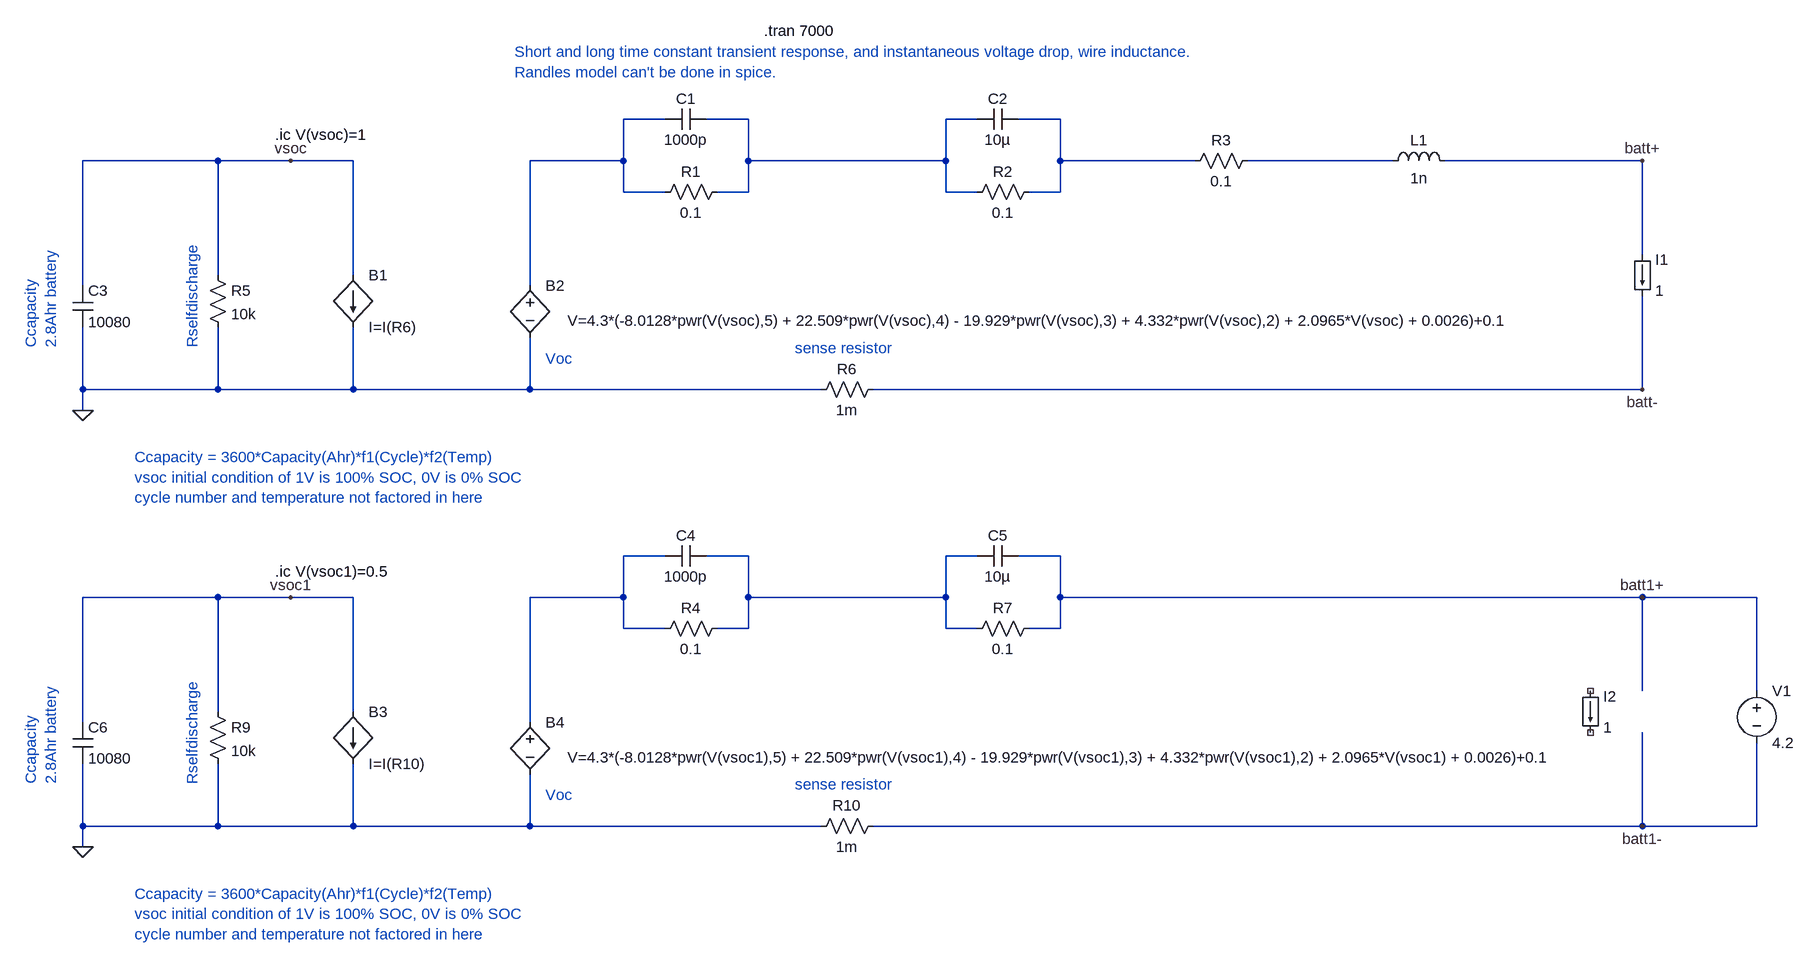
[diagram p0: schematic Lithium Battery Equivalent.asc]
Lithium Battery Equivalent.asc, the LTspice schematic file:
Version 4
SHEET 1 2012 1412
WIRE 48 64 -16 64
WIRE 176 64 112 64
WIRE 528 64 480 64
WIRE 656 64 592 64
WIRE -640 128 -848 128
WIRE -528 128 -640 128
WIRE -432 128 -528 128
WIRE -16 128 -16 64
WIRE -16 128 -160 128
WIRE 176 128 176 64
WIRE 480 128 480 64
WIRE 480 128 176 128
WIRE 656 128 656 64
WIRE 864 128 656 128
WIRE 1168 128 944 128
WIRE 1552 128 1248 128
WIRE -16 176 -16 128
WIRE 48 176 -16 176
WIRE 176 176 176 128
WIRE 176 176 128 176
WIRE 480 176 480 128
WIRE 528 176 480 176
WIRE 656 176 656 128
WIRE 656 176 608 176
WIRE 1552 272 1552 128
WIRE -640 304 -640 128
WIRE -432 304 -432 128
WIRE -848 320 -848 128
WIRE -160 320 -160 128
WIRE -848 480 -848 384
WIRE -640 480 -640 384
WIRE -640 480 -848 480
WIRE -432 480 -432 384
WIRE -432 480 -640 480
WIRE -160 480 -160 400
WIRE -160 480 -432 480
WIRE 288 480 -160 480
WIRE 1552 480 1552 336
WIRE 1552 480 368 480
WIRE -848 512 -848 480
WIRE 48 736 -16 736
WIRE 176 736 112 736
WIRE 528 736 480 736
WIRE 656 736 592 736
WIRE -640 800 -848 800
WIRE -528 800 -640 800
WIRE -432 800 -528 800
WIRE -16 800 -16 736
WIRE -16 800 -160 800
WIRE 176 800 176 736
WIRE 480 800 480 736
WIRE 480 800 176 800
WIRE 656 800 656 736
WIRE 1552 800 656 800
WIRE 1728 800 1552 800
WIRE -16 848 -16 800
WIRE 48 848 -16 848
WIRE 176 848 176 800
WIRE 176 848 128 848
WIRE 480 848 480 800
WIRE 528 848 480 848
WIRE 656 848 656 800
WIRE 656 848 608 848
WIRE 1552 944 1552 800
WIRE 1728 944 1728 800
WIRE -640 976 -640 800
WIRE -432 976 -432 800
WIRE -848 992 -848 800
WIRE -160 992 -160 800
WIRE -848 1152 -848 1056
WIRE -640 1152 -640 1056
WIRE -640 1152 -848 1152
WIRE -432 1152 -432 1056
WIRE -432 1152 -640 1152
WIRE -160 1152 -160 1072
WIRE -160 1152 -432 1152
WIRE 288 1152 -160 1152
WIRE 1552 1152 1552 1008
WIRE 1552 1152 368 1152
WIRE 1728 1152 1728 1024
WIRE 1728 1152 1552 1152
WIRE -848 1184 -848 1152
FLAG -848 512 0
FLAG -528 128 vsoc
FLAG 1552 128 batt+
FLAG 1552 480 batt-
FLAG -848 1184 0
FLAG -528 800 vsoc1
FLAG 1552 800 batt1+
FLAG 1552 1152 batt1-
SYMBOL res 144 160 R90
WINDOW 0 0 56 VBottom 2
WINDOW 3 32 56 VTop 2
SYMATTR InstName R1
SYMATTR Value 0.1
SYMBOL res 624 160 R90
WINDOW 0 0 56 VBottom 2
WINDOW 3 32 56 VTop 2
SYMATTR InstName R2
SYMATTR Value 0.1
SYMBOL res 960 112 R90
WINDOW 0 0 56 VBottom 2
WINDOW 3 32 56 VTop 2
SYMATTR InstName R3
SYMATTR Value 0.1
SYMBOL cap 112 48 R90
WINDOW 0 0 32 VBottom 2
WINDOW 3 32 32 VTop 2
SYMATTR InstName C1
SYMATTR Value 1000p
SYMBOL cap 592 48 R90
WINDOW 0 0 32 VBottom 2
WINDOW 3 32 32 VTop 2
SYMATTR InstName C2
SYMATTR Value 10µ
SYMBOL res -656 288 R0
SYMATTR InstName R5
SYMATTR Value 10k
SYMBOL cap -864 320 R0
SYMATTR InstName C3
SYMATTR Value 10080
SYMBOL bi -432 304 R0
SYMATTR InstName B1
SYMATTR Value I=I(R6)
SYMBOL res 384 464 R90
WINDOW 0 0 56 VBottom 2
WINDOW 3 32 56 VTop 2
SYMATTR InstName R6
SYMATTR Value 1m
SYMBOL bv -160 304 R0
WINDOW 3 58 70 Left 2
SYMATTR Value V=4.3*(-8.0128*pwr(V(vsoc),5) + 22.509*pwr(V(vsoc),4) - 19.929*pwr(V(vsoc),3) + 4.332*pwr(V(vsoc),2) + 2.0965*V(vsoc) + 0.0026)+0.1
SYMATTR InstName B2
SYMBOL ind 1152 144 R270
WINDOW 0 32 56 VTop 2
WINDOW 3 5 56 VBottom 2
SYMATTR InstName L1
SYMATTR Value 1n
SYMBOL load 1536 272 R0
WINDOW 123 0 0 Left 0
WINDOW 39 0 0 Left 0
SYMATTR InstName I1
SYMATTR Value 1
SYMBOL res 144 832 R90
WINDOW 0 0 56 VBottom 2
WINDOW 3 32 56 VTop 2
SYMATTR InstName R4
SYMATTR Value 0.1
SYMBOL res 624 832 R90
WINDOW 0 0 56 VBottom 2
WINDOW 3 32 56 VTop 2
SYMATTR InstName R7
SYMATTR Value 0.1
SYMBOL cap 112 720 R90
WINDOW 0 0 32 VBottom 2
WINDOW 3 32 32 VTop 2
SYMATTR InstName C4
SYMATTR Value 1000p
SYMBOL cap 592 720 R90
WINDOW 0 0 32 VBottom 2
WINDOW 3 32 32 VTop 2
SYMATTR InstName C5
SYMATTR Value 10µ
SYMBOL res -656 960 R0
SYMATTR InstName R9
SYMATTR Value 10k
SYMBOL cap -864 992 R0
SYMATTR InstName C6
SYMATTR Value 10080
SYMBOL bi -432 976 R0
SYMATTR InstName B3
SYMATTR Value I=I(R10)
SYMBOL res 384 1136 R90
WINDOW 0 0 56 VBottom 2
WINDOW 3 32 56 VTop 2
SYMATTR InstName R10
SYMATTR Value 1m
SYMBOL bv -160 976 R0
WINDOW 3 58 70 Left 2
SYMATTR Value V=4.3*(-8.0128*pwr(V(vsoc1),5) + 22.509*pwr(V(vsoc1),4) - 19.929*pwr(V(vsoc1),3) + 4.332*pwr(V(vsoc1),2) + 2.0965*V(vsoc1) + 0.0026)+0.1
SYMATTR InstName B4
SYMBOL load 1456 944 R0
WINDOW 123 0 0 Left 0
WINDOW 39 0 0 Left 0
SYMATTR InstName I2
SYMATTR Value 1
SYMBOL Voltage 1728 928 R0
SYMATTR InstName V1
SYMATTR Value 4.2
TEXT 200 -72 Left 2 !.tran 7000
TEXT -928 416 VLeft 2 ;Ccapacity\n2.8Ahr battery
TEXT -184 -40 Left 2 ;Short and long time constant transient response, and instantaneous voltage drop, wire inductance.\nRandles model can't be done in spice.
TEXT 248 416 Left 2 ;sense resistor
TEXT -136 432 Left 2 ;Voc
TEXT -552 88 Left 2 !.ic V(vsoc)=1
TEXT -768 584 Left 2 ;Ccapacity = 3600*Capacity(Ahr)*f1(Cycle)*f2(Temp)\nvsoc initial condition of 1V is 100% SOC, 0V is 0% SOC\ncycle number and temperature not factored in here
TEXT -680 416 VLeft 2 ;Rselfdischarge
TEXT -928 1088 VLeft 2 ;Ccapacity\n2.8Ahr battery
TEXT 248 1088 Left 2 ;sense resistor
TEXT -136 1104 Left 2 ;Voc
TEXT -552 760 Left 2 !.ic V(vsoc1)=0.5
TEXT -768 1256 Left 2 ;Ccapacity = 3600*Capacity(Ahr)*f1(Cycle)*f2(Temp)\nvsoc initial condition of 1V is 100% SOC, 0V is 0% SOC\ncycle number and temperature not factored in here
TEXT -680 1088 VLeft 2 ;Rselfdischarge

The netlist it stands for:
* Lithium Battery Equivalent.asc
R1 N002 N001 0.1
R2 N003 N002 0.1
R3 N004 N003 0.1
C1 N002 N001 1000p
C2 N003 N002 10µ
R5 vsoc 0 10k
C3 vsoc 0 10080
B1 vsoc 0 I=I(R6)
R6 batt- 0 1m
B2 N001 0 V=4.3*(-8.0128*pwr(V(vsoc),5) + 22.509*pwr(V(vsoc),4) - 19.929*pwr(V(vsoc),3) + 4.332*pwr(V(vsoc),2) + 2.0965*V(vsoc) + 0.0026)+0.1
L1 N004 batt+ 1n
I1 batt+ batt- 1
R4 N006 N005 0.1
R7 batt1+ N006 0.1
C4 N006 N005 1000p
C5 batt1+ N006 10µ
R9 vsoc1 0 10k
C6 vsoc1 0 10080
B3 vsoc1 0 I=I(R10)
R10 batt1- 0 1m
B4 N005 0 V=4.3*(-8.0128*pwr(V(vsoc1),5) + 22.509*pwr(V(vsoc1),4) - 19.929*pwr(V(vsoc1),3) + 4.332*pwr(V(vsoc1),2) + 2.0965*V(vsoc1) + 0.0026)+0.1
I2 NC_01 NC_02 1
V1 batt1+ batt1- 4.2
.tran 7000
* Ccapacity
* 2.8Ahr battery
* Short and long time constant transient response, and instantaneous voltage drop, wire inductance.
* Randles model can't be done in spice.
* sense resistor
* Voc
.ic V(vsoc)=1
* Ccapacity = 3600*Capacity(Ahr)*f1(Cycle)*f2(Temp)
* vsoc initial condition of 1V is 100% SOC, 0V is 0% SOC
* cycle number and temperature not factored in here
* Rselfdischarge
* Ccapacity
* 2.8Ahr battery
* sense resistor
* Voc
.ic V(vsoc1)=0.5
* Ccapacity = 3600*Capacity(Ahr)*f1(Cycle)*f2(Temp)
* vsoc initial condition of 1V is 100% SOC, 0V is 0% SOC
* cycle number and temperature not factored in here
* Rselfdischarge
.backanno
.end